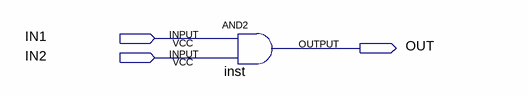
[diagram p0: schematic sheet]
// Quartus schematic none_test1.bdf as structural Verilog: 1 symbols, 3 pins
module none_test1 (
  input  IN1,
  input  IN2,
  output OUT
);

  and inst (OUT, IN1, IN2);
endmodule
